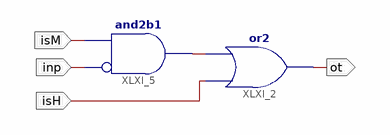
[diagram p0: schematic sheet 1]
// Xilinx ISE schematic SSDg.sch (xc9500xl) as structural Verilog: 2 symbols, 4 ports
module SSDg (
  input  inp,
  input  isM,
  input  isH,
  output ot
);

  wire XLXN_1;

  or XLXI_2 (ot, isH, XLXN_1);
  and XLXI_5 (XLXN_1, ~inp, isM);  // and2b1
endmodule
